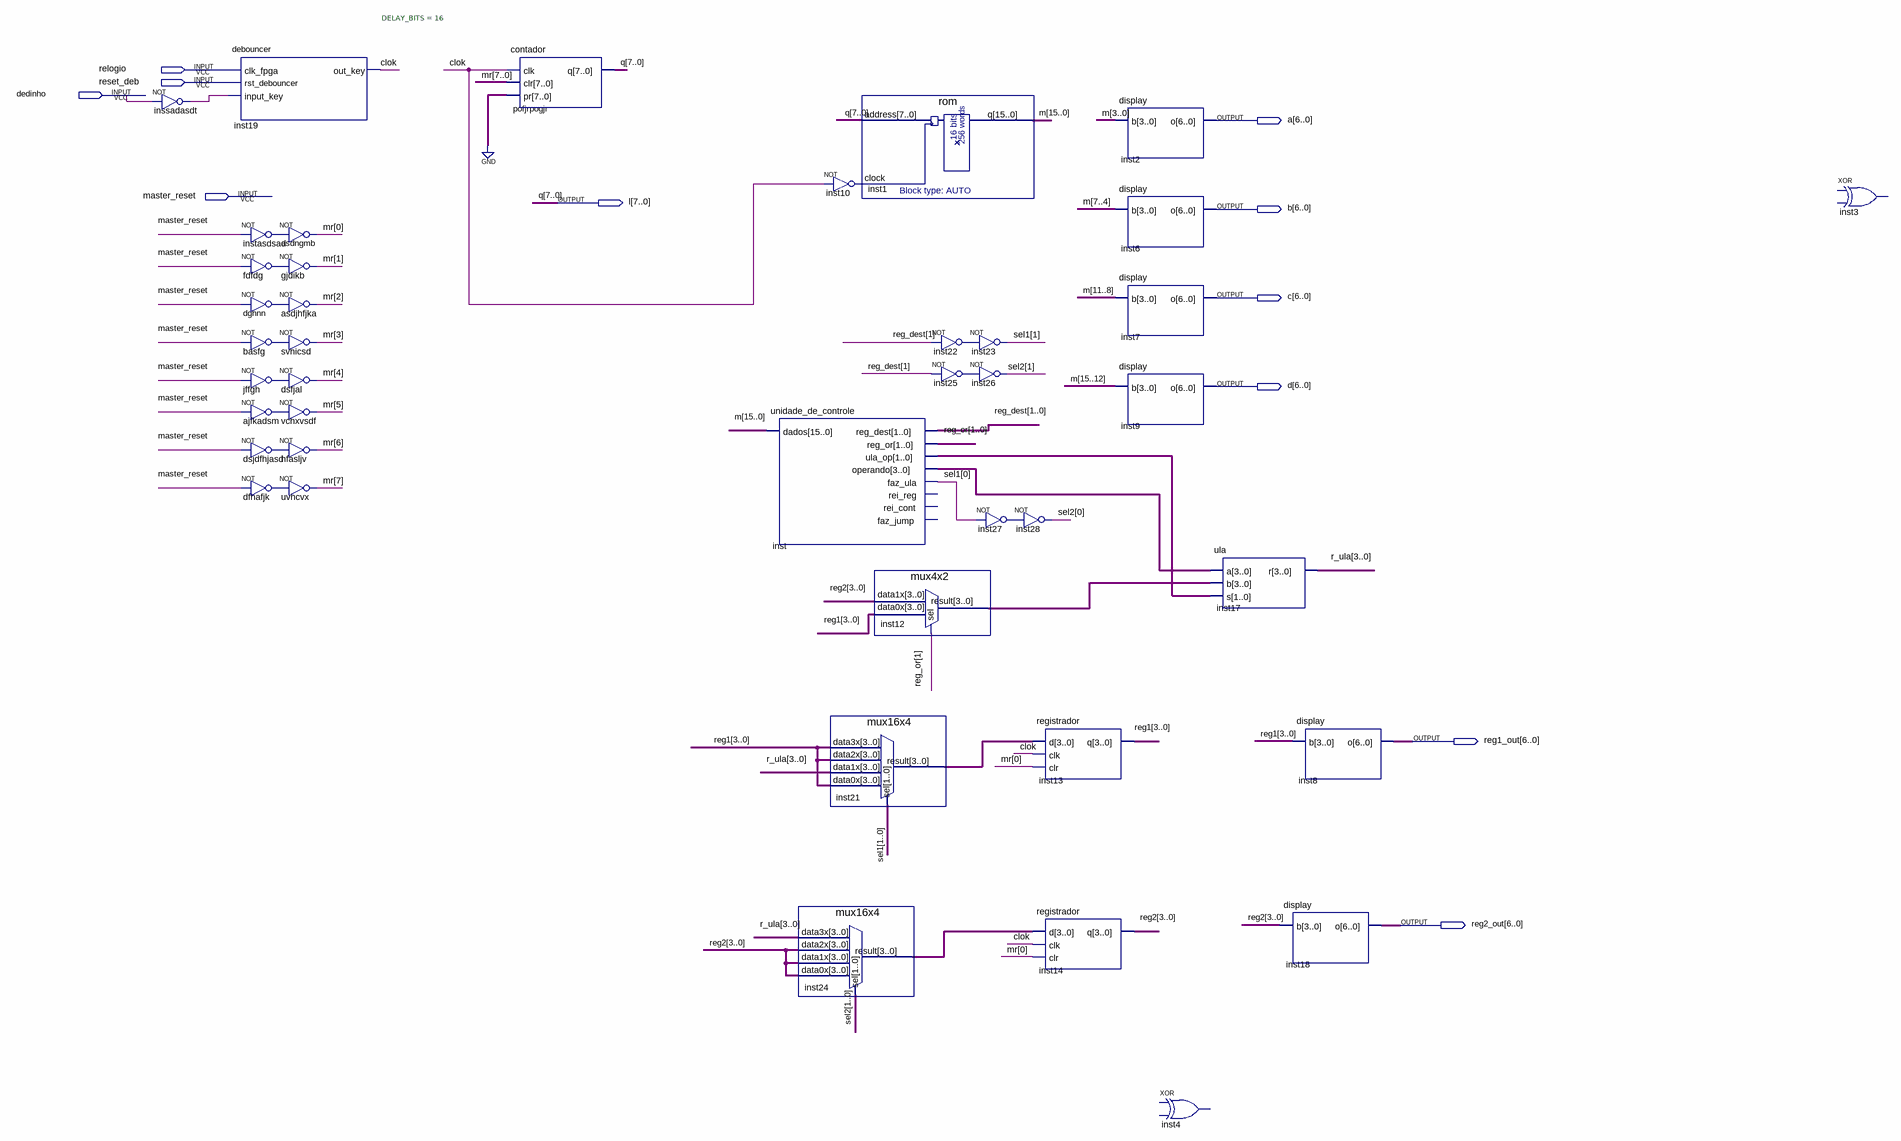
[diagram p0: schematic sheet]
// Quartus schematic cpu.bdf as structural Verilog: 42 symbols, 11 pins
module cpu (
  input  relogio,
  input  reset_deb,
  input  dedinho,
  input  master_reset,
  output [6:0] a,
  output [7:0] l,
  output [6:0] b,
  output [6:0] c,
  output [6:0] d,
  output [6:0] reg1_out,
  output [6:0] reg2_out
);

  wire ajfkadsm_out, basfg_out, clok, dfhafjk_out, dghnn_out, dsjdfhjasd_out, fdfdg_out, inssadasdt_out,
       inst10_out, inst22_out, inst25_out, inst27_out, instasdsad_out, jffgh_out;
  wire [1:0] inst_ula_op, reg_dest, reg_or, sel1, sel2;
  wire [3:0] inst12_result, inst21_result, inst24_result, inst_operando, r_ula, reg1, reg2;
  wire [7:0] mr;
  wire [15:0] m;

  not inssadasdt (inssadasdt_out, dedinho);
  debouncer #(.DELAY_BITS(16)) inst19 (
    .clk_fpga(relogio), .rst_debouncer(reset_deb), .input_key(inssadasdt_out), .out_key(clok));
  not instasdsad (instasdsad_out, master_reset);
  not fdfdg (fdfdg_out, master_reset);
  not dghnn (dghnn_out, master_reset);
  not basfg (basfg_out, master_reset);
  not jffgh (jffgh_out, master_reset);
  not ajfkadsm (ajfkadsm_out, master_reset);
  not dsjdfhjasd (dsjdfhjasd_out, master_reset);
  not dfhafjk (dfhafjk_out, master_reset);
  not asdngmb (mr[0], instasdsad_out);
  not gjdikb (mr[1], fdfdg_out);
  not asdjhfjka (mr[2], dghnn_out);
  not svhicsd (mr[3], basfg_out);
  not dsfjal (mr[4], jffgh_out);
  not vchxvsdf (mr[5], ajfkadsm_out);
  not hfasljv (mr[6], dsjdfhjasd_out);
  not uvhcvx (mr[7], dfhafjk_out);
  contador pofjrpogjr (.clk(clok), .clr(mr), .pr({8{1'b0}}), .q(l));
  unidade_de_controle inst (
    .dados(m), .reg_dest(reg_dest), .reg_or(reg_or), .ula_op(inst_ula_op), .operando(inst_operando),
    .faz_ula(sel1[0]));  // open: rei_reg, rei_cont, faz_jump
  mux16x4 inst24 (.data3x(r_ula), .data2x(reg2), .data1x(reg2), .data0x(reg2), .sel(sel2), .result(inst24_result));
  not inst10 (inst10_out, clok);
  mux16x4 inst21 (.data3x(reg1), .data2x(reg1), .data1x(r_ula), .data0x(reg1), .sel(sel1), .result(inst21_result));
  rom inst1 (.address(l), .clock(inst10_out), .q(m));
  mux4x2 inst12 (.data1x(reg2), .data0x(reg1), .sel(reg_or[1]), .result(inst12_result));
  not inst22 (inst22_out, reg_dest[1]);
  not inst25 (inst25_out, reg_dest[1]);
  not inst23 (sel1[1], inst22_out);
  not inst26 (sel2[1], inst25_out);
  not inst27 (inst27_out, sel1[0]);
  not inst28 (sel2[0], inst27_out);
  registrador inst13 (.d(inst21_result), .clk(clok), .clr(mr[0]), .q(reg1));
  registrador inst14 (.d(inst24_result), .clk(clok), .clr(mr[0]), .q(reg2));
  display inst2 (.b(m[3:0]), .o(a));
  display inst6 (.b(m[7:4]), .o(b));
  display inst7 (.b(m[11:8]), .o(c));
  display inst9 (.b(m[15:12]), .o(d));
  // XOR inst4 is placed but not wired
  ula inst17 (.a(inst_operando), .b(inst12_result), .s(inst_ula_op), .r(r_ula));
  display inst8 (.b(reg1), .o(reg1_out));
  display inst18 (.b(reg2), .o(reg2_out));
  // XOR inst3 is placed but not wired

  // Other names for the same wires on the sheet: q[7:0] = l
endmodule
